# EAGLE schematic ionode_dock (EAGLE 7.7.0)
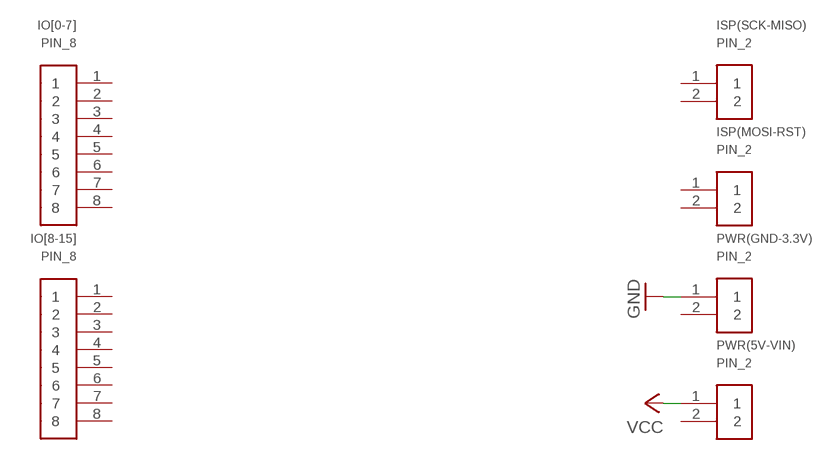
[diagram p0: schematic, sheet 1]

## Parts
IO[0-7]  PIN_8  [PIN_8]
IO[8-15]  PIN_8  [PIN_8]
ISP(MOSI-RST)  PIN_2  [PIN_2]
ISP(SCK-MISO)  PIN_2  [PIN_2]
PWR(5V-VIN)  PIN_2  [PIN_2]
PWR(GND-3.3V)  PIN_2  [PIN_2]

## Nets
GND: PWR(GND-3.3V).1
VCC: PWR(5V-VIN).1
Unconnected: IO[0-7].1 IO[0-7].2 IO[0-7].3 IO[0-7].4 IO[0-7].5 IO[0-7].6 IO[0-7].7 IO[0-7].8 IO[8-15].1 IO[8-15].2 IO[8-15].3 IO[8-15].4 IO[8-15].5 IO[8-15].6 IO[8-15].7 IO[8-15].8 ISP(MOSI-RST).1 ISP(MOSI-RST).2 ISP(SCK-MISO).1 ISP(SCK-MISO).2 PWR(5V-VIN).2 PWR(GND-3.3V).2

## Library data of the parts
IO[0-7] IO[8-15] = dooba:PIN_8
ISP(MOSI-RST) ISP(SCK-MISO) PWR(5V-VIN) PWR(GND-3.3V) = dooba:PIN_2